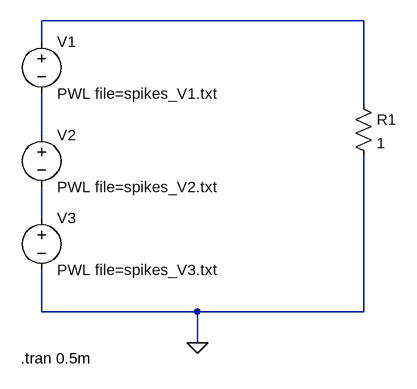
[diagram p0: schematic Pixelspikes.asc]
Pixelspikes.asc, the LTspice schematic file:
Version 4
SHEET 1 880 680
WIRE 464 -64 -32 -64
WIRE -32 -32 -32 -64
WIRE 464 64 464 -64
WIRE -32 112 -32 48
WIRE -32 240 -32 192
WIRE -32 384 -32 320
WIRE 208 384 -32 384
WIRE 464 384 464 144
WIRE 464 384 208 384
WIRE 208 432 208 384
FLAG 208 432 0
SYMBOL voltage -32 -48 R0
WINDOW 123 0 0 Left 0
WINDOW 39 0 0 Left 0
SYMATTR InstName V1
SYMATTR Value PWL file=spikes_V1.txt
SYMBOL voltage -32 96 R0
WINDOW 123 0 0 Left 0
WINDOW 39 0 0 Left 0
SYMATTR InstName V2
SYMATTR Value PWL file=spikes_V2.txt
SYMBOL voltage -32 224 R0
WINDOW 123 0 0 Left 0
WINDOW 39 0 0 Left 0
SYMATTR InstName V3
SYMATTR Value PWL file=spikes_V3.txt
SYMBOL res 448 48 R0
SYMATTR InstName R1
SYMATTR Value 1
TEXT -64 456 Left 2 !.tran 0.5m

The netlist it stands for:
* Pixelspikes.asc
V1 N001 N002 PWL file=spikes_V1.txt
V2 N002 N003 PWL file=spikes_V2.txt
V3 N003 0 PWL file=spikes_V3.txt
R1 N001 0 1
.tran 0.5m
.backanno
.end